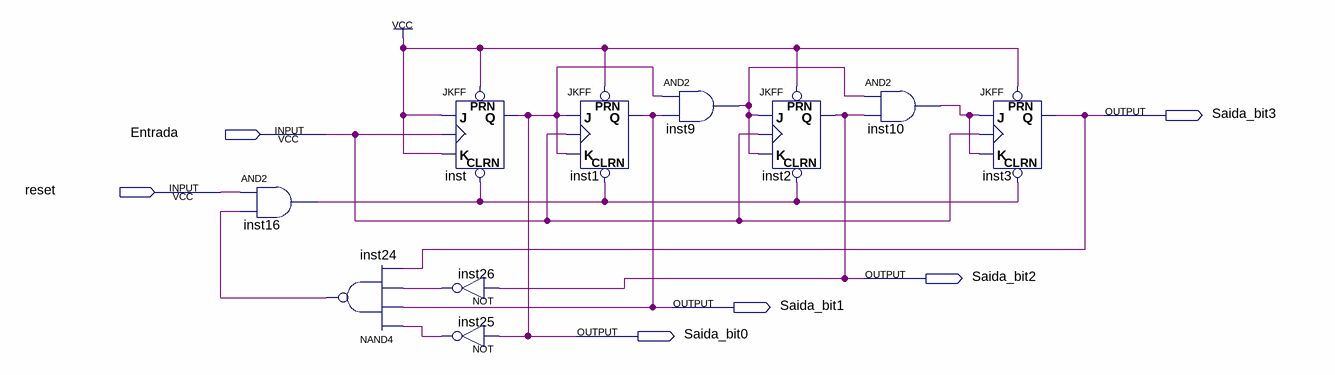
[diagram p0: schematic sheet]
// Quartus schematic contador.bdf as structural Verilog: 10 symbols, 6 pins
module contador (
  input  Entrada,
  input  reset,
  output Saida_bit3,
  output Saida_bit2,
  output Saida_bit1,
  output Saida_bit0
);

  wire inst9_out, inst10_out, inst16_out, inst24_out, inst25_out, inst26_out;

  and inst16 (inst16_out, reset, inst24_out);
  nand inst24 (inst24_out, inst25_out, Saida_bit1, inst26_out, Saida_bit3);
  JKFF inst (.PRN(1'b1), .CLRN(inst16_out), .K(1'b1), .J(1'b1), .CLK(Entrada), .Q(Saida_bit0));
  not inst26 (inst26_out, Saida_bit2);
  not inst25 (inst25_out, Saida_bit0);
  JKFF inst1 (.PRN(1'b1), .CLRN(inst16_out), .K(Saida_bit0), .J(Saida_bit0), .CLK(Entrada), .Q(Saida_bit1));
  and inst9 (inst9_out, Saida_bit0, Saida_bit1);
  JKFF inst2 (.PRN(1'b1), .CLRN(inst16_out), .K(inst9_out), .J(inst9_out), .CLK(Entrada), .Q(Saida_bit2));
  and inst10 (inst10_out, inst9_out, Saida_bit2);
  JKFF inst3 (.PRN(1'b1), .CLRN(inst16_out), .K(inst10_out), .J(inst10_out), .CLK(Entrada), .Q(Saida_bit3));
endmodule
